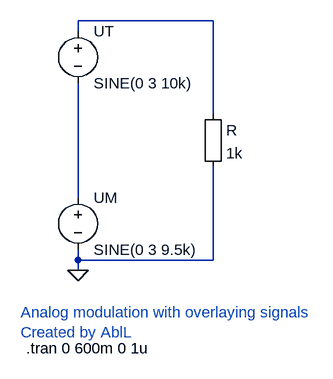
[diagram p0: schematic Analoge-Modulation_Überlagerung.asc]
Analoge-Modulation_Überlagerung.asc, the LTspice schematic file:
Version 4
SHEET 1 880 680
WIRE 256 -32 48 -32
WIRE 48 -16 48 -32
WIRE 256 112 256 -32
WIRE 48 240 48 64
WIRE 48 336 48 320
WIRE 256 336 256 192
WIRE 256 336 48 336
WIRE 48 352 48 336
FLAG 48 352 0
SYMBOL Misc\\EuropeanResistor 240 96 R0
SYMATTR InstName R
SYMATTR Value 1k
SYMBOL voltage 48 -32 R0
WINDOW 123 0 0 Left 0
WINDOW 39 0 0 Left 0
SYMATTR InstName UT
SYMATTR Value SINE(0 3 10k)
SYMBOL voltage 48 224 R0
WINDOW 123 0 0 Left 0
WINDOW 39 0 0 Left 0
SYMATTR InstName UM
SYMATTR Value SINE(0 3 9.5k)
TEXT -32 472 Left 2 !.tran 0 600m 0 1u
TEXT -40 416 Left 2 ;Analog modulation with overlaying signals\nCreated by AblL

The netlist it stands for:
* Analoge-Modulation_Überlagerung.asc
R N001 0 1k
V§UT N001 N002 SINE(0 3 10k)
V§UM N002 0 SINE(0 3 9.5k)
.tran 0 600m 0 1u
* Analog modulation with overlaying signals
* Created by AblL
.backanno
.end